# Altium schematic sheet buttons.SchDoc
size A
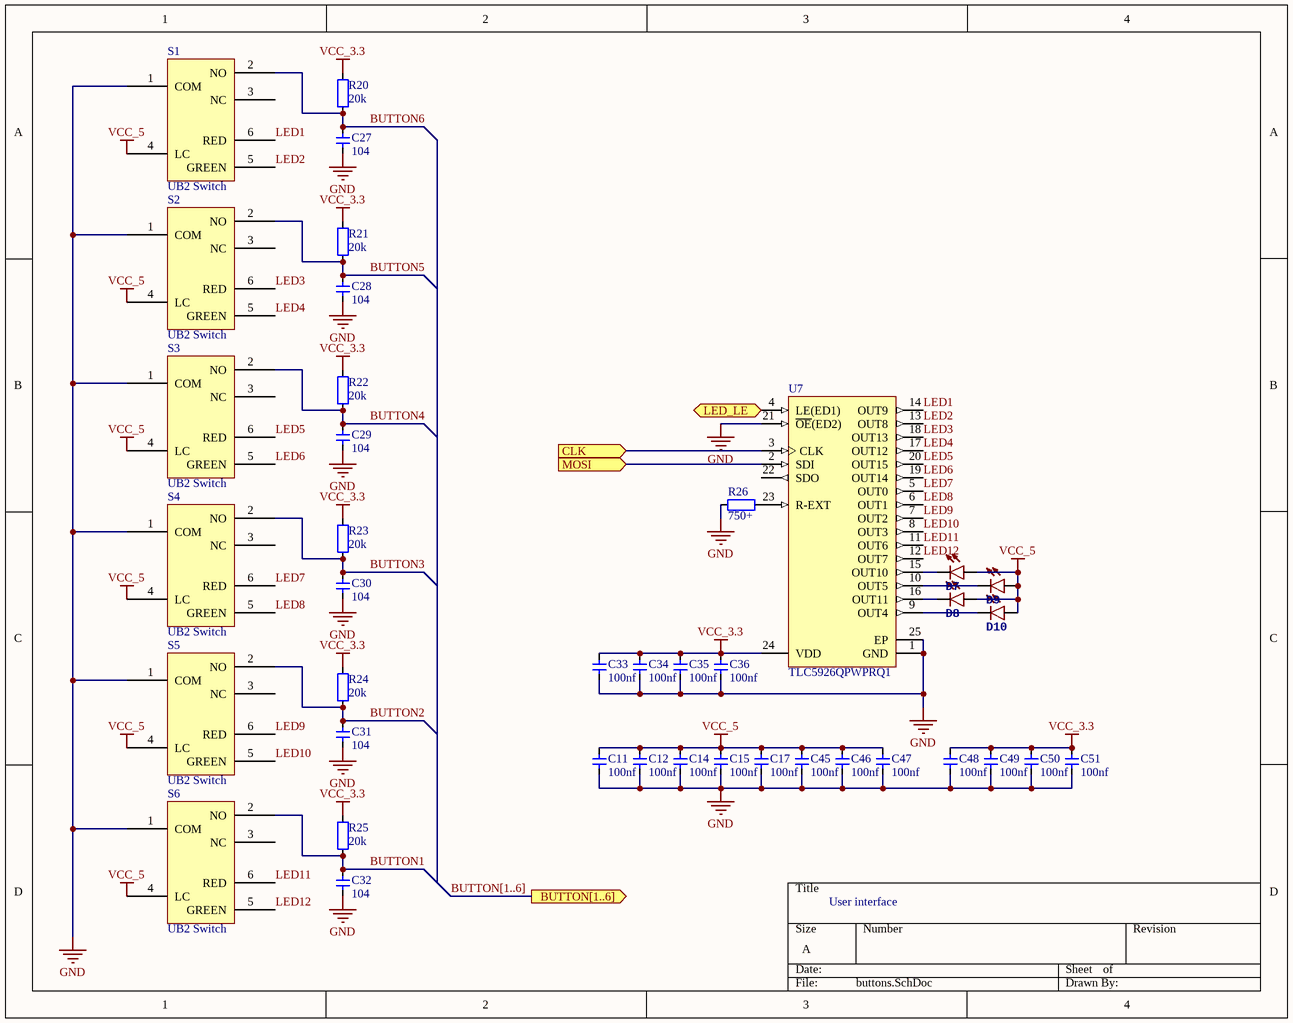
[diagram p0: buttons.SchDoc]

## Parts
C11  value 100nf  [CAP_0603]  (hidden comment: Cap_0603)
C12  value 100nf  [CAP_0603]  (hidden comment: Cap_0603)
C14  value 100nf  [CAP_0603]  (hidden comment: Cap_0603)
C15  value 100nf  [CAP_0603]  (hidden comment: Cap_0603)
C17  value 100nf  [CAP_0603]  (hidden comment: Cap_0603)
C27  value 104  [CAP_0603]  (hidden comment: Cap_0603)
C28  value 104  [CAP_0603]  (hidden comment: Cap_0603)
C29  value 104  [CAP_0603]  (hidden comment: Cap_0603)
C30  value 104  [CAP_0603]  (hidden comment: Cap_0603)
C31  value 104  [CAP_0603]  (hidden comment: Cap_0603)
C32  value 104  [CAP_0603]  (hidden comment: Cap_0603)
C33  value 100nf  [CAP_0603]  (hidden comment: Cap_0603)
C34  value 100nf  [CAP_0603]  (hidden comment: Cap_0603)
C35  value 100nf  [CAP_0603]  (hidden comment: Cap_0603)
C36  value 100nf  [CAP_0603]  (hidden comment: Cap_0603)
C45  value 100nf  [CAP_0603]  (hidden comment: Cap_0603)
C46  value 100nf  [CAP_0603]  (hidden comment: Cap_0603)
C47  value 100nf  [CAP_0603]  (hidden comment: Cap_0603)
C48  value 100nf  [CAP_0603]  (hidden comment: Cap_0603)
C49  value 100nf  [CAP_0603]  (hidden comment: Cap_0603)
C50  value 100nf  [CAP_0603]  (hidden comment: Cap_0603)
C51  value 100nf  [CAP_0603]  (hidden comment: Cap_0603)
D7  (no value)  [LED3MM]
D8  (no value)  [LED3MM]
D9  (no value)  [LED3MM]
D10  (no value)  [LED3MM]
R20  value 20k  [RES_0603]  (hidden comment: Res_0603)
R21  value 20k  [RES_0603]  (hidden comment: Res_0603)
R22  value 20k  [RES_0603]  (hidden comment: Res_0603)
R23  value 20k  [RES_0603]  (hidden comment: Res_0603)
R24  value 20k  [RES_0603]  (hidden comment: Res_0603)
R25  value 20k  [RES_0603]  (hidden comment: Res_0603)
R26  value 750+  [RES_0603]  (hidden comment: Res_0603)
S1  UB2 Switch  [EXTRON CLICKY]
S2  UB2 Switch  [EXTRON CLICKY]
S3  UB2 Switch  [EXTRON CLICKY]
S4  UB2 Switch  [EXTRON CLICKY]
S5  UB2 Switch  [EXTRON CLICKY]
S6  UB2 Switch  [EXTRON CLICKY]
U7  TLC5926QPWPRQ1  [TI-PWP24-4420X1950TP_N]

## Ports
BUTTON[1..6] (out), CLK (in), LED_LE (in), MOSI (in)

## Nets
GND: C11.1 C12.1 C14.1 C15.1 C17.1 C27.1 C28.1 C29.1 C30.1 C31.1 C32.1 C33.1 C34.1 C35.1 C36.1 C45.1 C46.1 C47.1 C48.1 C49.1 C50.1 C51.1 R26.2 S1.1(COM) S2.1(COM) S3.1(COM) S4.1(COM) S5.1(COM) S6.1(COM) U7.1(GND) U7.21(~{OE}(ED2)) U7.25(EP)
VCC_3.3: C33.2 C34.2 C35.2 C36.2 C48.2 C49.2 C50.2 C51.2 R20.2 R21.2 R22.2 R23.2 R24.2 R25.2 U7.24(VDD)
VCC_5: C11.2 C12.2 C14.2 C15.2 C17.2 C45.2 C46.2 C47.2 D7.A D8.A D9.A D10.A S1.4(LC) S2.4(LC) S3.4(LC) S4.4(LC) S5.4(LC) S6.4(LC)
BUTTON1: C32.2 R25.1 S6.2(NO)
BUTTON2: C31.2 R24.1 S5.2(NO)
BUTTON3: C30.2 R23.1 S4.2(NO)
BUTTON4: C29.2 R22.1 S3.2(NO)
BUTTON5: C28.2 R21.1 S2.2(NO)
BUTTON6: C27.2 R20.1 S1.2(NO)
CLK: U7.3(CLK) ; port CLK
LED1: S1.6(RED) U7.14(OUT9)
LED2: S1.5(GREEN) U7.13(OUT8)
LED3: S2.6(RED) U7.18(OUT13)
LED4: S2.5(GREEN) U7.17(OUT12)
LED5: S3.6(RED) U7.20(OUT15)
LED6: S3.5(GREEN) U7.19(OUT14)
LED7: S4.6(RED) U7.5(OUT0)
LED8: S4.5(GREEN) U7.6(OUT1)
LED9: S5.6(RED) U7.7(OUT2)
LED10: S5.5(GREEN) U7.8(OUT3)
LED11: S6.6(RED) U7.11(OUT6)
LED12: S6.5(GREEN) U7.12(OUT7)
LED_LE: U7.4(LE(ED1)) ; port LED_LE
MOSI: U7.2(SDI) ; port MOSI
NetD7_K: D7.K(C) U7.15(OUT10)
NetD8_K: D8.K(C) U7.16(OUT11)
NetD9_K: D9.K(C) U7.10(OUT5)
NetD10_K: D10.K(C) U7.9(OUT4)
NetR26_1: R26.1 U7.23(R-EXT)

Not connected (* = marked no-connect by the designer): S1 3(NC); S2 3(NC); S3 3(NC); S4 3(NC); S5 3(NC); S6 3(NC); U7 22(SDO)

## Buses and harness runs
bus BUTTON[1..6] = port BUTTON[1..6]

## Notes on the sheet
- User interface

## Library data of the parts
C11 C12 C14 C15 C17 C27-C36 C45-C51 = Cap_0603: Capacitor
D7-D10 = LED3MM: PROD_ID: DIO-08794
R20-R26 = Res_0603: Resistor
S1-S6 = EXTRON CLICKY
U7 = TLC5926QPWPRQ1: Automotive Catalog 16-Bit Constant-Current LED Sink Driver, 3 to 5.5 V, -40 to 125 degC, 24-pin SOP (PWP24), Green (RoHS & no Sb/Br); Manufacturer: Texas Instruments; Iout(Max)(A): 0.12; SubFamily: LED Driver; Vin(Max)(V): 5.5; Vin(Min)(V): 3; DatasheetVersion: SLVS973; PackageVersion: 4073225-5/I; PackageReference: PWP24-4420X1950TP; PackageDescription: 24-Lead, Plastic Small Outline, Body Size 4.4 x 7.8 mm, Pitch 0.65 mm; Supplier 1: Digi-Key; Supplier Part Number 1: 296-24948-2-ND; Supplier 2: Digi-Key; Supplier Part Number 2: 296-24948-1-ND; Supplier 3: Digi-Key; Supplier Part Number 3: 296-24948-6-ND; Supplier 4: Newark; Supplier Part Number 4: 24R9990; Supplier 5: Mouser; Supplier Part Number 5: 595-TLC5926QPWPRQ1; Eco-Plan: Green (RoHS & no Sb/Br); Mounting Technology: Surface Mount; Code_JEDEC: MO-153; PartNumber: TLC5926QPWPRQ1; ComponentLink1Description: Manufacturer URL; ComponentLink1URL: http://www.ti.com/; ComponentLink2Description: Datasheet; ComponentLink2URL: http://www.ti.com/general/docs/lit/getliterature.tsp?genericPartNumber=TLC5926-Q1&fileType=pdf; ComponentLink3Description: Package Specification; ComponentLink3URL: http://www.ti.com/lit/ds/symlink/tps65101.pdf